# Altium project Dash.PrjPcb
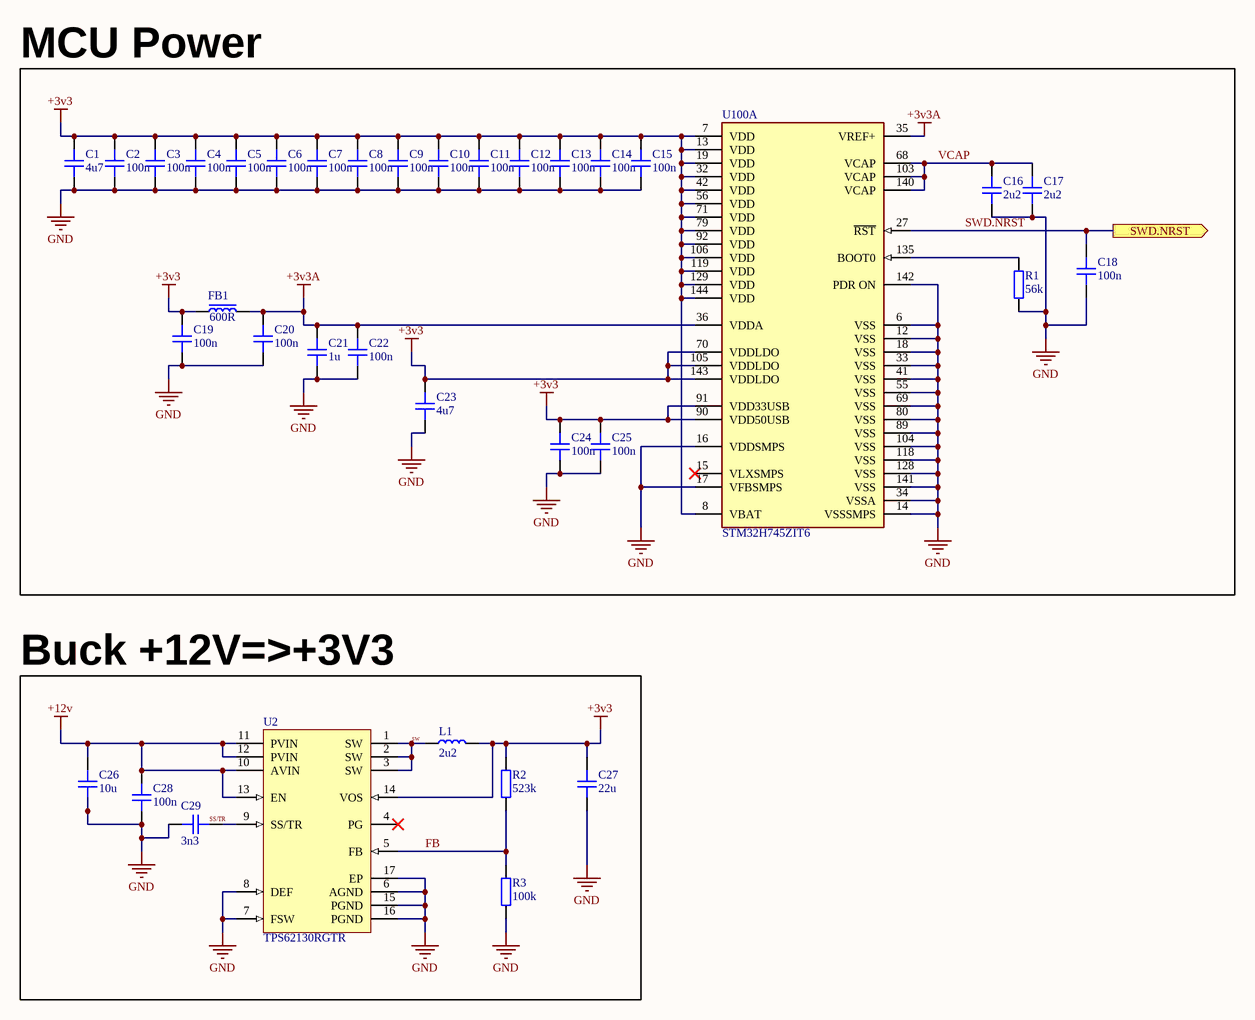
[diagram p0: Power.SchDoc]
3 sheets, 65 parts. Net scope: flat (ports and power ports of the same name join across sheets).
Board file: PCB.PcbDoc
Sheets:
  Power.SchDoc
  IO.SchDoc
  RF.SchDoc

## Sheet Power.SchDoc: POWER
size A3; DrawnBy: Gad; Revision: 0.1v; SheetNumber: 1; SheetTotal: 3; PageTitle: POWER

### Parts
C1  4u7  [CAP_0603]
C2  100n  [CAP_0402]
C3  100n  [CAP_0402]
C4  100n  [CAP_0402]
C5  100n  [CAP_0402]
C6  100n  [CAP_0402]
C7  100n  [CAP_0402]
C8  100n  [CAP_0402]
C9  100n  [CAP_0402]
C10  100n  [CAP_0402]
C11  100n  [CAP_0402]
C12  100n  [CAP_0402]
C13  100n  [CAP_0402]
C14  100n  [CAP_0402]
C15  100n  [CAP_0402]
C16  2u2  [CAP_0402]
C17  2u2  [CAP_0402]
C18  100n  [CAP_0402]
C19  100n  [CAP_0402]
C20  100n  [CAP_0402]
C21  1u  [CAP_0402]
C22  100n  [CAP_0402]
C23  4u7  [CAP_0603]
C24  100n  [CAP_0402]
C25  100n  [CAP_0402]
C26  10u  [CAP_0805]
C27  22u  [CAP_0805]
C28  100n  [CAP_0402]
C29  3n3  [CAP_0402]
FB1  600R  [FB_0603]
L1  2u2  [IND_1008]
R1  56k  [RES_0402]
R2  523k  [RES_0402]
R3  100k  [RES_0402]
U2  TPS62130RGTR  [RGT0016C_V]
U100  STM32H745ZIT6  [FP-LQFP144-1A-MFG]  (part A of 3)

### Blocks framed on the sheet
MCU Power: C1-C25 FB1 R1 U100
Buck +12V=>+3V3: C26-C29 L1 R2 R3 U2

### Ports
SWD.NRST (out, see IO[3C])

### Nets
+3v3: C1.2 C2.2 C3.2 C4.2 C5.2 C6.2 C7.2 C8.2 C9.2 C10.2 C11.2 C12.2 C13.2 C14.2 C15.2 C19.2 C23.2 C24.2 C25.2 C27.2 FB1.1 L1.2 R2.2 U2.14(VOS) U100.7(VDD) U100.8(VBAT) U100.13(VDD) U100.19(VDD) U100.32(VDD) U100.42(VDD) U100.56(VDD) U100.70(VDDLDO) U100.71(VDD) U100.79(VDD) U100.90(VDD50USB) U100.91(VDD33USB) U100.92(VDD) U100.105(VDDLDO) U100.106(VDD) U100.119(VDD) U100.129(VDD) U100.143(VDDLDO) U100.144(VDD)
+3v3A: C20.2 C21.2 C22.2 FB1.2 U100.35(VREF+) U100.36(VDDA)
+12v: C26.2 C28.2 U2.10(AVIN) U2.11(PVIN) U2.12(PVIN) U2.13(EN)
GND: C1.1 C2.1 C3.1 C4.1 C5.1 C6.1 C7.1 C8.1 C9.1 C10.1 C11.1 C12.1 C13.1 C14.1 C15.1 C16.1 C17.1 C18.1 C19.1 C20.1 C21.1 C22.1 C23.1 C24.1 C25.1 C26.1 C27.1 C28.1 C29.2 R1.1 R3.1 U2.6(AGND) U2.7(FSW) U2.8(DEF) U2.15(PGND) U2.16(PGND) U2.17(EP) U100.6(VSS) U100.12(VSS) U100.14(VSSSMPS) U100.16(VDDSMPS) U100.17(VFBSMPS) U100.18(VSS) U100.33(VSS) U100.34(VSSA) U100.41(VSS) U100.55(VSS) U100.69(VSS) U100.80(VSS) U100.89(VSS) U100.104(VSS) U100.118(VSS) U100.128(VSS) U100.141(VSS) U100.142(PDR_ON)
FB: R2.1 R3.2 U2.5(FB)
SW: L1.1 U2.1(SW) U2.2(SW) U2.3(SW)
SWD.NRST: C18.2 U100.27(~{RST}) ; port SWD.NRST
VCAP: C16.2 C17.2 U100.68(VCAP) U100.103(VCAP) U100.140(VCAP)
NetC29_1: C29.1 U2.9(SS/TR)
NetR1_2: R1.2 U100.135(BOOT0)

Not connected (* = marked no-connect by the designer): U2 4(PG)*; U100 15(VLXSMPS)*

### Notes on the sheet
- Labels drawn without touching a wire or pin: SS/TR
- Title
- Size
- Rev
- Date:
- File:
- A3
- Drawn By:

### Library data of the parts
C1 C23 = CAP_0603: Capacitor SMD 0603; Manufacturer: *; Manufacturer Part Number: *; Distributor Link: *; LCSC: *; Rating: *; Dielectric: *
C2-C22 C24 C25 C28 C29 = CAP_0402: Capacitor SMD 0402; Manufacturer: *; Manufacturer Part Number: *; Distributor Link: *; LCSC: *; Rating: *; Dielectric: *
C26 C27 = CAP_0805: Capacitor SMD 0805; Manufacturer: *; Manufacturer Part Number: *; Distributor Link: *; LCSC: *; Rating: *; Dielectric: *
FB1 = FB_0603: Ferrite Bead SMD 0603 2A 350mΩ 600Ω@100MHz ±25%; Manufacturer: *; Manufacturer Part Number: *; Distributor Link: *; LCSC: *
L1 = IND_1008: Inductor SMD 1008
R1-R3 = RES_0402: Resistor SMD 0402; Manufacturer: *; Manufacturer Part Number: *; Distributor Link: *; LCSC: *
U2 = CMP-0323-00115-3: Buck Step Down Regulator with 3 to 17 V Input and 0.9 to 6 V Output, -40 to 85 degC, 16-Pin QFN (RGT), Green (RoHS & no Sb/Br); Manufacturer: Texas Instruments; Rating: Catalog; Vout(Max)(V): 6; Vin(Min)(V): 3; Switch Current Limit(Typ)(A): 4.2; Iq(Typ)(mA): 0.017; Regulated Outputs(#): 1; Synchronous Rectification: TRUE; SubFamily: Step-Down Regulator; Vin(Max)(V): 17; Duty Cycle(Max)(%): 100; Vout(Min)(V): 0.9; ComponentLink2URL: http://www.ti.com/litv/pdf/mpqf119g; Eco-Plan: Green (RoHS & no Sb/Br); PartNumber: TPS62130RGTR; ComponentLink1Description: Datasheet; DatasheetVersion: SLVSAG7; Mounting Technology: Surface Mount; Iout(Max)(A): 3; ComponentLink2Description: Package Specification; Code_JEDEC: MO-220; Topology: Buck; ComponentLink1URL: http://www.ti.com/general/docs/lit/getliterature.tsp?genericPartNumber=TPS62130&fileType=pdf; ComponentLink3URL: Samples URL:http://www.ti.com/product/tps62130#samples; ComponentLink3Description: URL Link1; PackageReference: RGT0016C; PackageVersion: revH, Oct-2011; PackageDescription: 16-Pin Plastic Quad Flat No-Lead, 3 x 3 mm Body, 0.5 mm Pitch, 1.7 x 1.7 mm Exposed Pad
U100 = CMP-12105-000054-1: HIGH-PERFORMANCE AND DSP WITH DP; Manufacturer: STMicroelectronics; Number Of Timers/Counters: 20; Min Supply Voltage: 1.62V; Frequency: 480MHz; Number Of I2C Channels: 4; Memory Type: FLASH; Number Of I/Os: 97; Number Of Pwm Channels: 42; Number Of Usb Channels: 2; Ram Size: 1MBytes; Memory Size: 2MBytes; Data Bus Width: 32bits; Number Of Adc Channels: 23; Number Of Ethernet Channels: 1; Number Of Uart Channels: 9; Interface: I2C,SPI,UART,USART,CAN,USB,LIN,IrDA,Ethernet,I2S,Other; Number Of A/D Converters: 3; Max Junction Temp: +125°C; Max Supply Voltage: 3.6V; Core Architecture: ARM Cortex-M4, Cortex-M7; Number Of Spi Channels: 6; Standoff Height: 0.05mm; Ambient Temperature Range Low: -40°C; Lead Free: Yes; Manufacturer Part Number: STM32H745ZIT6; Automotive: No; Height: 1.6mm; Device Class L1: Integrated Circuits (ICs); Ambient Temperature Range High: +85°C; RoHS: TRUE; Temperature Range High: +125°C; Temperature: -40°C to +125°C; Category: IC; Device Class L2: Embedded Processors and Controllers; Number Of Cores: 2; Temperature Range Low: -40°C; Octopart: https://octopart.com/stm32h745zit6-stmicroelectronics-100293939; Digikey Description: HIGH-PERFORMANCE AND DSP WITH DP; Package: LQFP144-1A; Device Class L3: Microcontrollers; ComponentLink2URL: https://www.st.com/resource/en/datasheet/stm32h745zi.pdf; ComponentLink2Description: Datasheet

## Sheet IO.SchDoc: I/O
size A3; DrawnBy: Gad; Revision: 0.1v; SheetNumber: 2; SheetTotal: 3; PageTitle: I/O
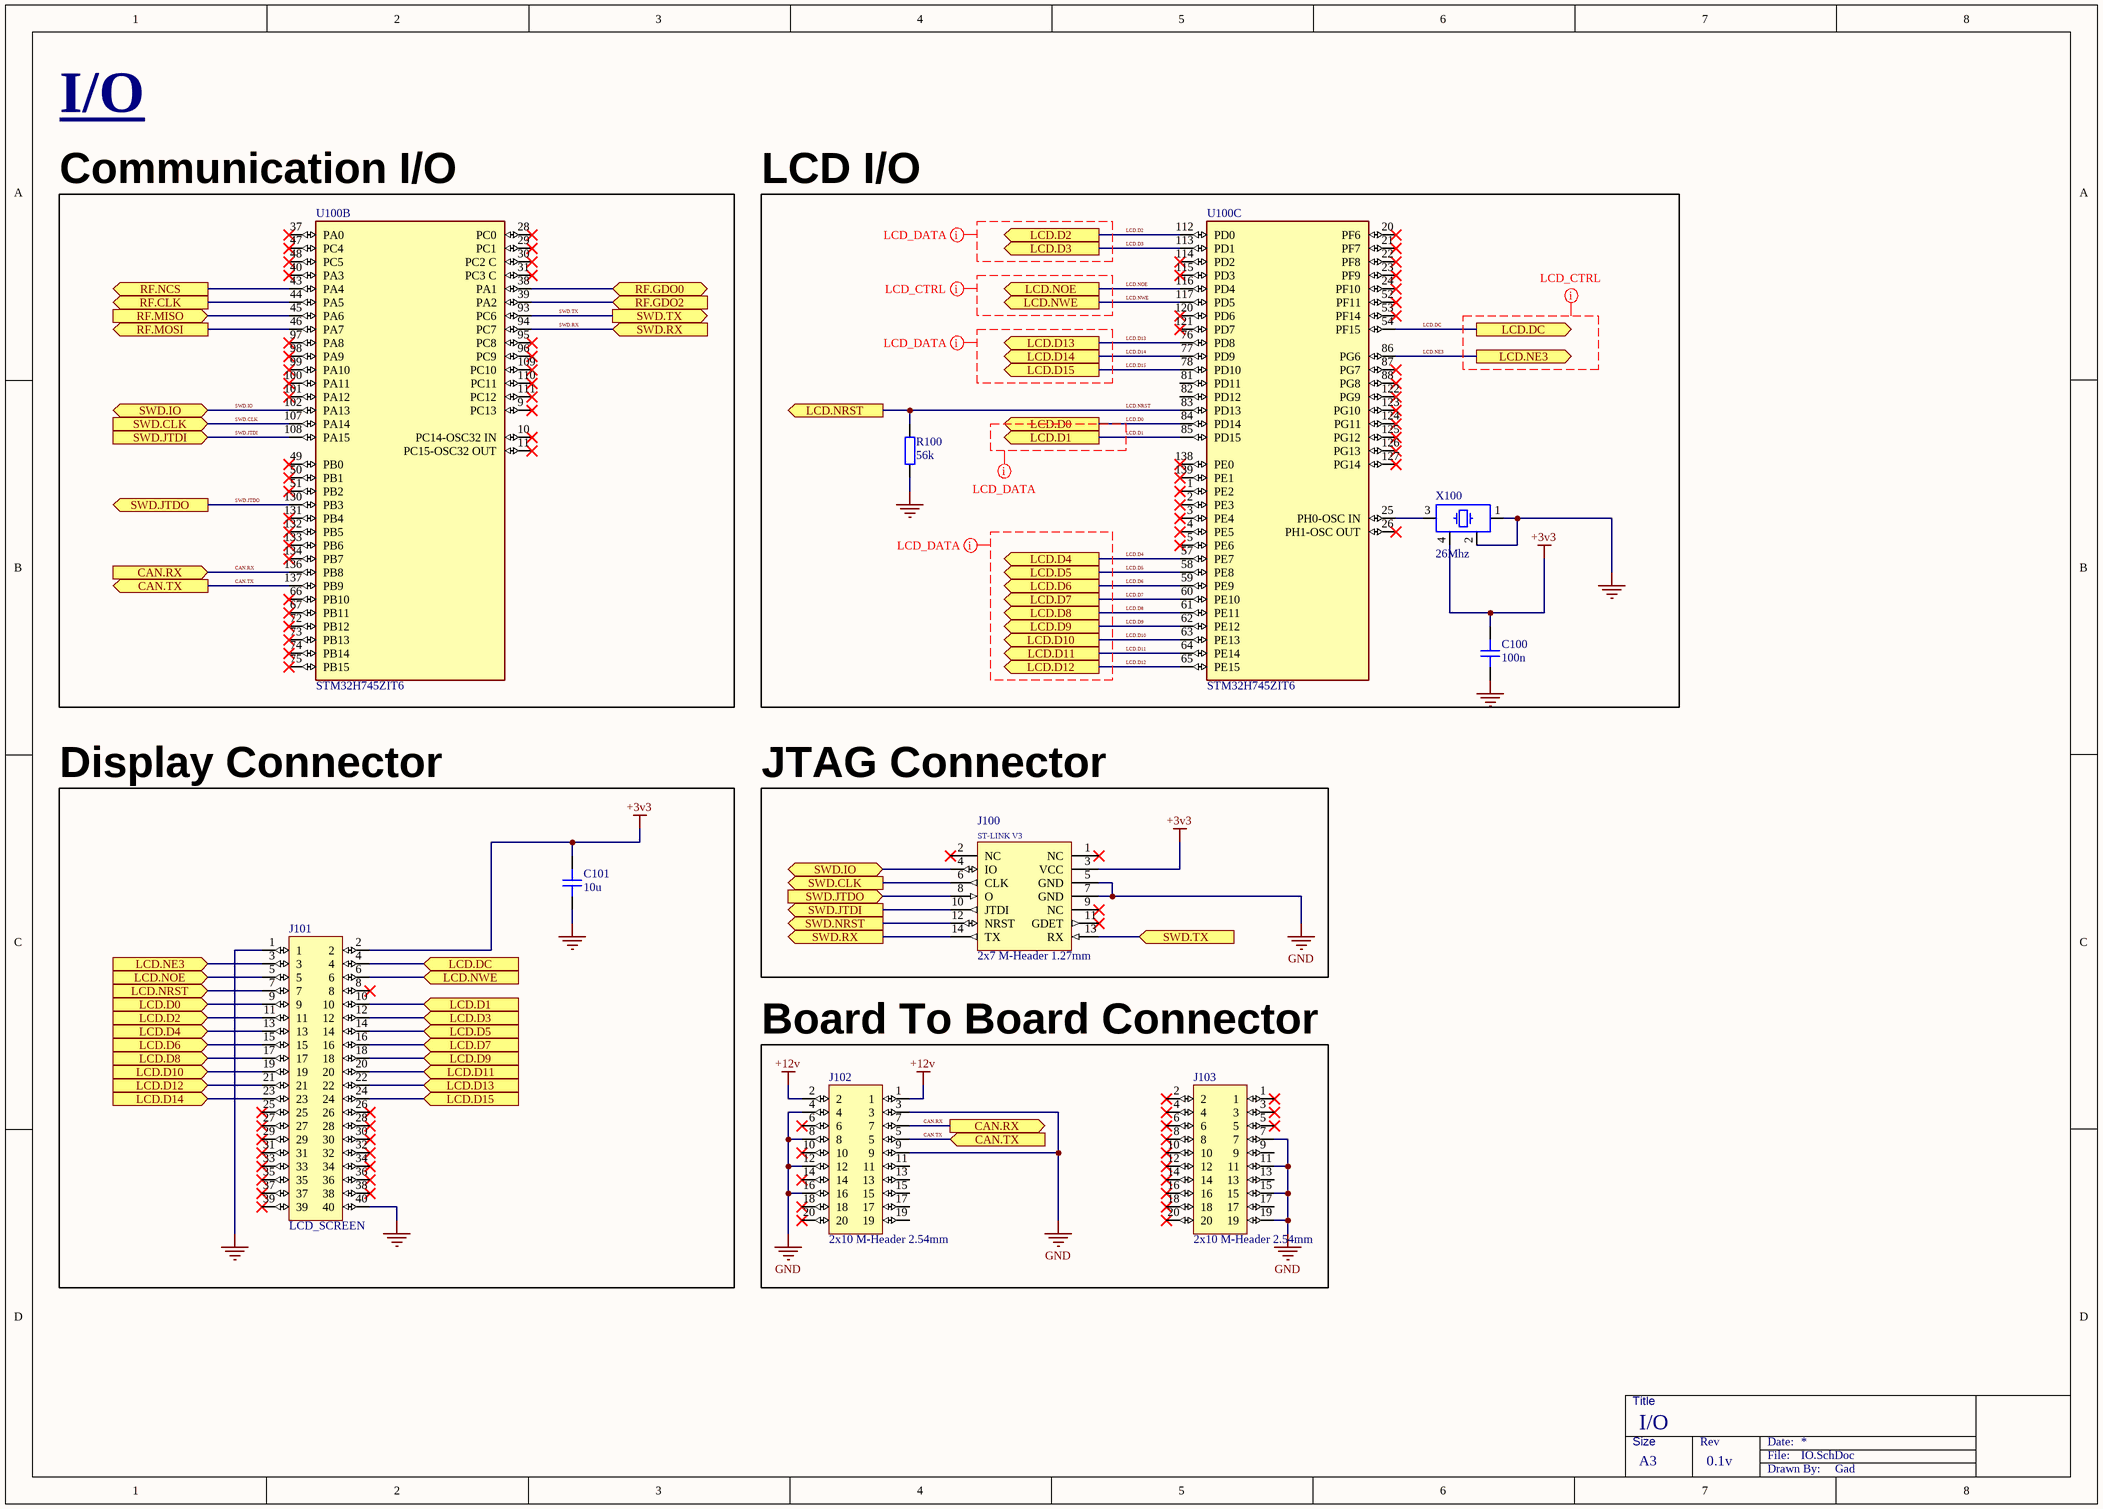
[diagram p1: IO.SchDoc]

### Parts
C100  100n  [CAP_0402]
C101  10u  [CAP_0603]
J100  2x7 M-Header 1.27mm  [2x7 M-Header 1.27mm]
J101  LCD_SCREEN  [LCD_Screen]
J102  2x10 M-Header 2.54mm  [2x10 M-Header 2.54mm]
J103  2x10 M-Header 2.54mm  [2x10 M-Header 2.54mm]
R100  56k  [RES_0402]
U100  STM32H745ZIT6  [FP-LQFP144-1A-MFG]  (parts B,C of 3)
X100  26Mhz  [XTAL_2520]

### Blocks framed on the sheet
Communication I/O: U100
LCD I/O: C100 R100 U100 X100
Display Connector: C101 J101
JTAG Connector: J100
Board To Board Connector: J102 J103

### Ports
CAN.RX (in, see IO[4C]), CAN.RX (out, see IO[1B]), CAN.TX (in, see IO[1B]), CAN.TX (out, see IO[4D]), LCD.D0 (in, see IO[4B]), LCD.D0 (out, see IO[1C]), LCD.D1 (in, see IO[4B]), LCD.D1 (out, see IO[2C]), LCD.D2 (in, see IO[4A]), LCD.D2 (out, see IO[1C]), LCD.D3 (in, see IO[4A]), LCD.D3 (out, see IO[2C]), LCD.D4 (in, see IO[4B]), LCD.D4 (out, see IO[1C]), LCD.D5 (in, see IO[4B]), LCD.D5 (out, see IO[2C]), LCD.D6 (in, see IO[4B]), LCD.D6 (out, see IO[1C]), LCD.D7 (in, see IO[4B]), LCD.D7 (out, see IO[2C]), LCD.D8 (in, see IO[4B]), LCD.D8 (out, see IO[1C]), LCD.D9 (in, see IO[4B]), LCD.D9 (out, see IO[2C]), LCD.D10 (in, see IO[4B]), LCD.D10 (out, see IO[1C]), LCD.D11 (in, see IO[4B]), LCD.D11 (out, see IO[2C]), LCD.D12 (in, see IO[4B]), LCD.D12 (out, see IO[1C]), LCD.D13 (in, see IO[4A]), LCD.D13 (out, see IO[2C]), LCD.D14 (in, see IO[4A]), LCD.D14 (out, see IO[1C]), LCD.D15 (in, see IO[4A]), LCD.D15 (out, see IO[2C]), LCD.DC (in, see IO[6A]), LCD.DC (out, see IO[2C]), LCD.NE3 (in, see IO[6A]), LCD.NE3 (out, see IO[1C]), LCD.NOE (in, see IO[4A]), LCD.NOE (out, see IO[1C]), LCD.NRST (in, see IO[3B]), LCD.NRST (out, see IO[1C]), LCD.NWE (in, see IO[4A]), LCD.NWE (out, see IO[2C]), RF.CLK (out, see RF[5B]), RF.GDO0 (bidir, see RF[3B]), RF.GDO2 (in, see RF[3B]), RF.MISO (in, see RF[5B]), RF.MOSI (out, see RF[5B]), RF.NCS (out, see RF[5A]), SWD.CLK (in, see IO[3C]), SWD.CLK (out, see IO[1B]), SWD.IO (bidir, see IO[1B]), SWD.IO (bidir, see IO[3C]), SWD.JTDI (in, see IO[3C]), SWD.JTDI (out, see IO[1B]), SWD.JTDO (in, see IO[1B]), SWD.JTDO (out, see IO[3C]), SWD.NRST (out, see Power[5B]), SWD.RX (in, see IO[3C]), SWD.RX (out, see IO[3A]), SWD.TX (in, see IO[3A]), SWD.TX (out, see IO[5C])

### Nets
+3v3: C100.1 C101.1 J100.3(VCC) J101.2 X100.4
+12v: J102.1 J102.2
GND: C100.2 C101.2 J100.5(GND) J100.7(GND) J101.1 J101.40 J102.3 J102.4 J102.8 J102.9 J102.12 J102.16 J103.7 J103.11 J103.15 J103.19 R100.1 X100.1 X100.2
CAN.RX: J102.7 U100.136(PB8) ; port CAN.RX
CAN.TX: J102.5 U100.137(PB9) ; port CAN.TX
LCD.D0: J101.9 U100.84(PD14) ; port LCD.D0
LCD.D1: J101.10 U100.85(PD15) ; port LCD.D1
LCD.D2: J101.11 U100.112(PD0) ; port LCD.D2
LCD.D3: J101.12 U100.113(PD1) ; port LCD.D3
LCD.D4: J101.13 U100.57(PE7) ; port LCD.D4
LCD.D5: J101.14 U100.58(PE8) ; port LCD.D5
LCD.D6: J101.15 U100.59(PE9) ; port LCD.D6
LCD.D7: J101.16 U100.60(PE10) ; port LCD.D7
LCD.D8: J101.17 U100.61(PE11) ; port LCD.D8
LCD.D9: J101.18 U100.62(PE12) ; port LCD.D9
LCD.D10: J101.19 U100.63(PE13) ; port LCD.D10
LCD.D11: J101.20 U100.64(PE14) ; port LCD.D11
LCD.D12: J101.21 U100.65(PE15) ; port LCD.D12
LCD.D13: J101.22 U100.76(PD8) ; port LCD.D13
LCD.D14: J101.23 U100.77(PD9) ; port LCD.D14
LCD.D15: J101.24 U100.78(PD10) ; port LCD.D15
LCD.DC: J101.4 U100.54(PF15) ; port LCD.DC
LCD.NE3: J101.3 U100.86(PG6) ; port LCD.NE3
LCD.NOE: J101.5 U100.116(PD4) ; port LCD.NOE
LCD.NRST: J101.7 R100.2 U100.83(PD13) ; port LCD.NRST
LCD.NWE: J101.6 U100.117(PD5) ; port LCD.NWE
RF.CLK: U100.44(PA5) ; port RF.CLK
RF.GDO0: U100.38(PA1) ; port RF.GDO0
RF.GDO2: U100.39(PA2) ; port RF.GDO2
RF.MISO: U100.45(PA6) ; port RF.MISO
RF.MOSI: U100.46(PA7) ; port RF.MOSI
RF.NCS: U100.43(PA4) ; port RF.NCS
SWD.CLK: J100.6(CLK) U100.107(PA14) ; port SWD.CLK
SWD.IO: J100.4(IO) U100.102(PA13) ; port SWD.IO
SWD.JTDI: J100.10(JTDI) U100.108(PA15) ; port SWD.JTDI
SWD.JTDO: J100.8(O) U100.130(PB3) ; port SWD.JTDO
SWD.NRST: J100.12(NRST) ; port SWD.NRST
SWD.RX: J100.14(TX) U100.94(PC7) ; port SWD.RX
SWD.TX: J100.13(RX) U100.93(PC6) ; port SWD.TX
NetU100_25: U100.25(PH0-OSC_IN) X100.3

Not connected (* = marked no-connect by the designer): J100 1(NC)* 2(NC)* 9(NC)* 11(GDET)*; J101 8* 25* 26* 27* 28* 29* 30* 31* 32* 33* 34* 35* 36* 37* 38* 39*; J102 6* 10* 11 13 14* 15 17 18* 19 20*; J103 1* 2* 3* 4* 5* 6* 8* 9 10* 12* 13 14* 16* 17 18* 20*; U100 1(PE2)* 2(PE3)* 3(PE4)* 4(PE5)* 5(PE6)* 9(PC13)* 10(PC14-OSC32_IN)* 11(PC15-OSC32_OUT)* 20(PF6)* 21(PF7)* 22(PF8)* 23(PF9)* 24(PF10)* 26(PH1-OSC_OUT)* 28(PC0)* 29(PC1)* 30(PC2_C)* 31(PC3_C)* 37(PA0)* 40(PA3)* 47(PC4)* 48(PC5)* 49(PB0)* 50(PB1)* 51(PB2)* 52(PF11)* 53(PF14)* 66(PB10)* 67(PB11)* 72(PB12)* 73(PB13)* 74(PB14)* 75(PB15)* 81(PD11) 82(PD12) 87(PG7)* 88(PG8)* 95(PC8)* 96(PC9)* 97(PA8)* 98(PA9)* 99(PA10)* 100(PA11)* 101(PA12)* 109(PC10)* 110(PC11)* 111(PC12)* 114(PD2)* 115(PD3)* 120(PD6)* 121(PD7)* 122(PG9)* 123(PG10)* 124(PG11)* 125(PG12)* 126(PG13)* 127(PG14)* 131(PB4)* 132(PB5)* 133(PB6)* 134(PB7)* 138(PE0)* 139(PE1)*

### Layout directives
net class LCD_DATA: (no net found under the mark), LCD.D0, LCD.D1
net class LCD_CTRL: (no net found under the mark)

### Notes on the sheet
- Title
- Size
- Rev
- Date:
- File:
- A3
- Drawn By:
- (in symbol 2x7 M-Header 1.27mm) ST-LINK V3

### Library data of the parts
C100 = CAP_0402: Capacitor SMD 0402 X7R 50V 10% 100nF; Manufacturer: *; Manufacturer Part Number: *; LCSC: *; Dielectric: *; Distributor Link: *; Rating: *
C101 = CAP_0603: Capacitor SMD 0603 X5R 25V 10% 10uF; Manufacturer: *; Manufacturer Part Number: *; LCSC: *; Dielectric: *; Distributor Link: *; Rating: *
J100 = 2x7 M-Header 1.27mm: ST-LINK v3-minie Connector
R100 = RES_0402: Resistor SMD Thick Film 0402 75V 100mW 1% 56kΩ; Manufacturer: *; Manufacturer Part Number: *; LCSC: *; Distributor Link: *
U100 = CMP-12105-000054-1: as U100 on sheet Power; Ambient Temperature Range Low: -40°C; Lead Free: Yes; Manufacturer Part Number: STM32H745ZIT6; Automotive: No; Height: 1.6mm; Device Class L1: Integrated Circuits (ICs); Ambient Temperature Range High: +85°C; RoHS: TRUE; Temperature Range High: +125°C; Temperature: -40°C to +125°C; Category: IC; Device Class L2: Embedded Processors and Controllers; Number Of Cores: 2; Temperature Range Low: -40°C; Octopart: https://octopart.com/stm32h745zit6-stmicroelectronics-100293939; Digikey Description: HIGH-PERFORMANCE AND DSP WITH DP; Package: LQFP144-1A; Device Class L3: Microcontrollers; ComponentLink2URL: https://www.st.com/resource/en/datasheet/stm32h745zi.pdf; ComponentLink2Description: Datasheet
X100 = XTAL_2520: Crystal SMD 2520; Manufacturer Part Number: OW3EL89CENUNFAYLC-26M; Distributor Link: *

## Sheet RF.SchDoc: RF
size A3; DrawnBy: Gad; Revision: 0.1v; SheetNumber: 3; SheetTotal: 3; PageTitle: RF
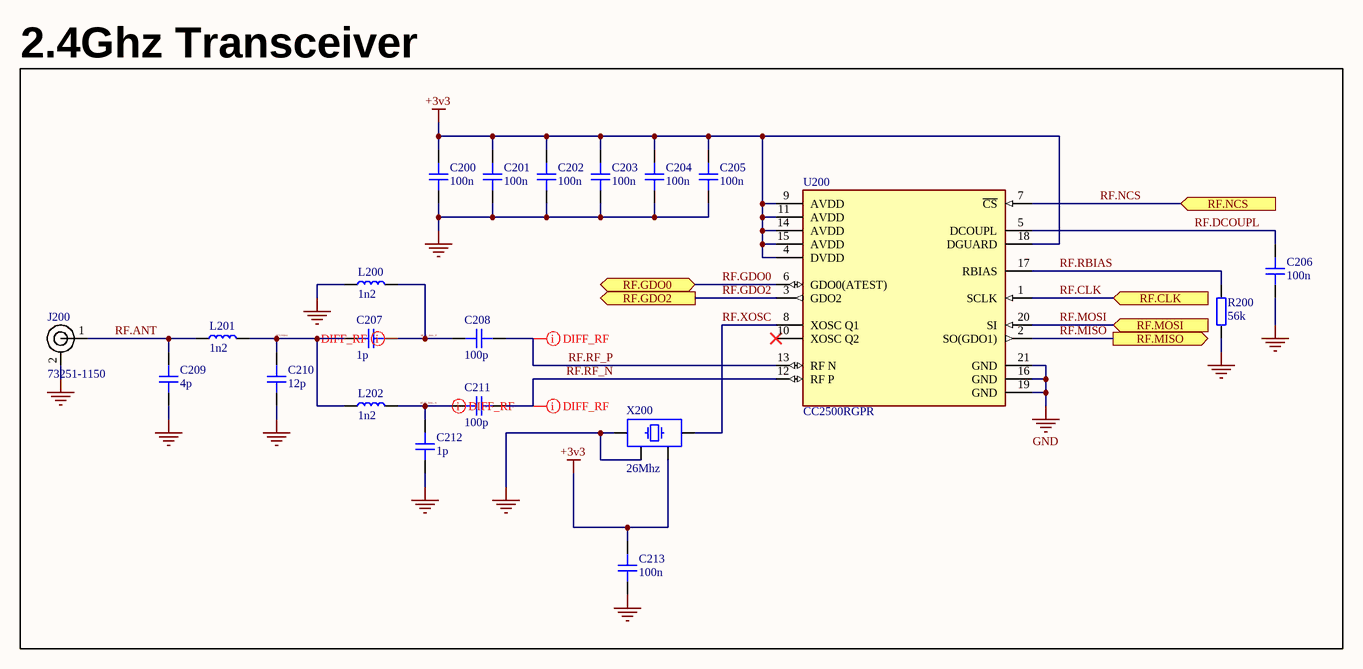
[diagram p2: RF.SchDoc]

### Parts
C200  100n  [CAP_0402]
C201  100n  [CAP_0402]
C202  100n  [CAP_0402]
C203  100n  [CAP_0402]
C204  100n  [CAP_0402]
C205  100n  [CAP_0402]
C206  100n  [CAP_0402]
C207  1p  [CAP_0402]
C208  100p  [CAP_0402]
C209  4p  [CAP_0402]
C210  12p  [CAP_0402]
C211  100p  [CAP_0402]
C212  1p  [CAP_0402]
C213  100n  [CAP_0402]
J200  73251-1150  [73251-1150]
L200  1n2  [IND_0402]
L201  1n2  [IND_0402]
L202  1n2  [IND_0402]
R200  56k  [RES_0402]
U200  CC2500RGPR  [FP-RGP0020C-MFG]
X200  26Mhz  [XTAL_2520]

### Blocks framed on the sheet
2.4Ghz Transceiver: C200-C213 J200 L200-L202 R200 U200 X200

### Ports
RF.CLK (in, see IO[1A]), RF.GDO0 (bidir, see IO[3A]), RF.GDO2 (out, see IO[3A]), RF.MISO (out, see IO[1A]), RF.MOSI (in, see IO[1A]), RF.NCS (in, see IO[1A])

### Nets
+3v3: C200.1 C201.1 C202.1 C203.1 C204.1 C205.1 C213.1 U200.4(DVDD) U200.9(AVDD) U200.11(AVDD) U200.14(AVDD) U200.15(AVDD) U200.18(DGUARD) X200.2
GND: C200.2 C201.2 C202.2 C203.2 C204.2 C205.2 C206.2 C209.2 C210.2 C212.2 C213.2 J200.2 L200.2 R200.1 U200.16(GND) U200.19(GND) U200.21(GND) X200.3 X200.4
RF.ANT: C209.1 J200.1 L201.2
RF.CLK: U200.1(SCLK) ; port RF.CLK
RF.DCOUPL: C206.1 U200.5(DCOUPL)
RF.GDO0: U200.6(GDO0(ATEST)) ; port RF.GDO0
RF.GDO2: U200.3(GDO2) ; port RF.GDO2
RF.MISO: U200.2(SO(GDO1)) ; port RF.MISO
RF.MOSI: U200.20(SI) ; port RF.MOSI
RF.NCS: U200.7(~{CS}) ; port RF.NCS
RF.RBIAS: R200.2 U200.17(RBIAS)
RF.RF_BAL_N: C211.1 C212.1 L202.1
RF.RF_BAL_P: C207.2 C208.1 L200.1
RF.RF_N: C211.2 U200.12(RF_P)
RF.RF_P: C208.2 U200.13(RF_N)
RF.UNBAL: C207.1 C210.1 L201.1 L202.2
RF.XOSC: U200.8(XOSC_Q1) X200.1

Not connected (* = marked no-connect by the designer): U200 10(XOSC_Q2)*

### Layout directives
differential pair; differential pair class DIFF_RF: RF.RF_BAL_N, RF.RF_BAL_P, RF.RF_N, RF.RF_P

### Notes on the sheet
- Title
- Size
- Rev
- Date:
- File:
- A3
- Drawn By:

### Library data of the parts
C200-C205 C213 = CAP_0402: Capacitor SMD 0402 X7R 50V 10% 100nF; Manufacturer: *; Manufacturer Part Number: *; LCSC: *; Dielectric: *; Distributor Link: *; Rating: *
C206 = cap_0402: Capacitor SMD 0402 X7R 50V 10% 100nF; Manufacturer: *; Manufacturer Part Number: *; LCSC: *; Dielectric: *; Distributor Link: *; Rating: *
C207 C212 = CAP_0402: Capacitor SMD 0402 C0G 50V +-0.25pF 1pF; Manufacturer: *; Manufacturer Part Number: *; LCSC: *; Dielectric: *; Distributor Link: *; Rating: *
C208 = CAP_0402: Capacitor SMD 0402 C0G 100V 1% 100pF; Manufacturer: *; Manufacturer Part Number: *; LCSC: *; Dielectric: *; Distributor Link: *; Rating: *
C209 = CAP_0402: Capacitor SMD 0402 C0G 50V +-0.25pF 4pF; Manufacturer: *; Manufacturer Part Number: *; Dielectric: *; Distributor Link: *; LCSC: *; Rating: *
C210 = CAP_0402: Capacitor SMD 0402 C0G 50V 2% 12pF; Manufacturer: *; Manufacturer Part Number: *; LCSC: *; Dielectric: *; Distributor Link: *; Rating: *
C211 = CAP_0402: Capacitor SMD 0402 C0G 100V 1% 100pFCapacitor SMD 0402 C0G 100V 1% 100pF; Manufacturer: *; Manufacturer Part Number: *; LCSC: *; Dielectric: *; Distributor Link: *; Rating: *
J200 = 73251-1150: RF Connector 50 Ohms, SMA Jack Receptacle, Edge Mount, .25µm Gold (Au) Plating; Manufacturer: Molex; Manufacturer Part Number: 73251-1150
L200 L201 = IND_0402: Inductor SMD 0402 RF Unshielded 1.2nH 1A 70mΩ +-0.3nH
L202 = ind_0402: Inductor SMD 0402 RF Unshielded 1.2nH 1A 70mΩ +-0.3nH
R200 = RES_0402: as R100 on sheet IO; Manufacturer: *; Manufacturer Part Number: *; LCSC: *; Distributor Link: *
U200 = CMP-04924-000028-1: IC RF TXRX ISM>1GHZ 20VFQFN; Max Frequency: 2.4835GHz; Number of Transmitters: 1; Min Supply Voltage: 1.8V; Max Supply Voltage: 3.6V; Frequency: 2.4GHz; Interface: SPI; Density: 0B; Data Rate: 500Kbps; Current - Transmitting: 21.5mA; Sensitivity: -104dBm; Current - Receiving: 19.6mA; Mount: Surface Mount; REACH SVHC: No SVHC; Package Quantity: 3000; Packaging: Tape and Reel; Contact Plating: Gold; Max Operating Temperature: 85°C; Length: 4.15mm; Depth: 4.15mm; RoHS Compliant: Yes; Lead Free: Lead Free; Min Operating Temperature: -40°C; Number of Pins: 20; Number of Receivers: 1; Case/Package: VQFN
X200 = XTAL_2520: as X100 on sheet IO; Distributor Link: *

## Nets that join several sheets
+3v3: Power (43 pins), IO (5 pins), RF (14 pins)
+12v: Power (6 pins), IO (J102.1 J102.2)
GND: Power (55 pins), IO (19 pins), RF (19 pins)
RF.CLK: IO (U100.44), RF (U200.1)
RF.GDO0: IO (U100.38), RF (U200.6)
RF.GDO2: IO (U100.39), RF (U200.3)
RF.MISO: IO (U100.45), RF (U200.2)
RF.MOSI: IO (U100.46), RF (U200.20)
RF.NCS: IO (U100.43), RF (U200.7)
SWD.NRST: Power (C18.2 U100.27), IO (J100.12)